# Altium schematic sheet fpga_power.SchDoc
size A4
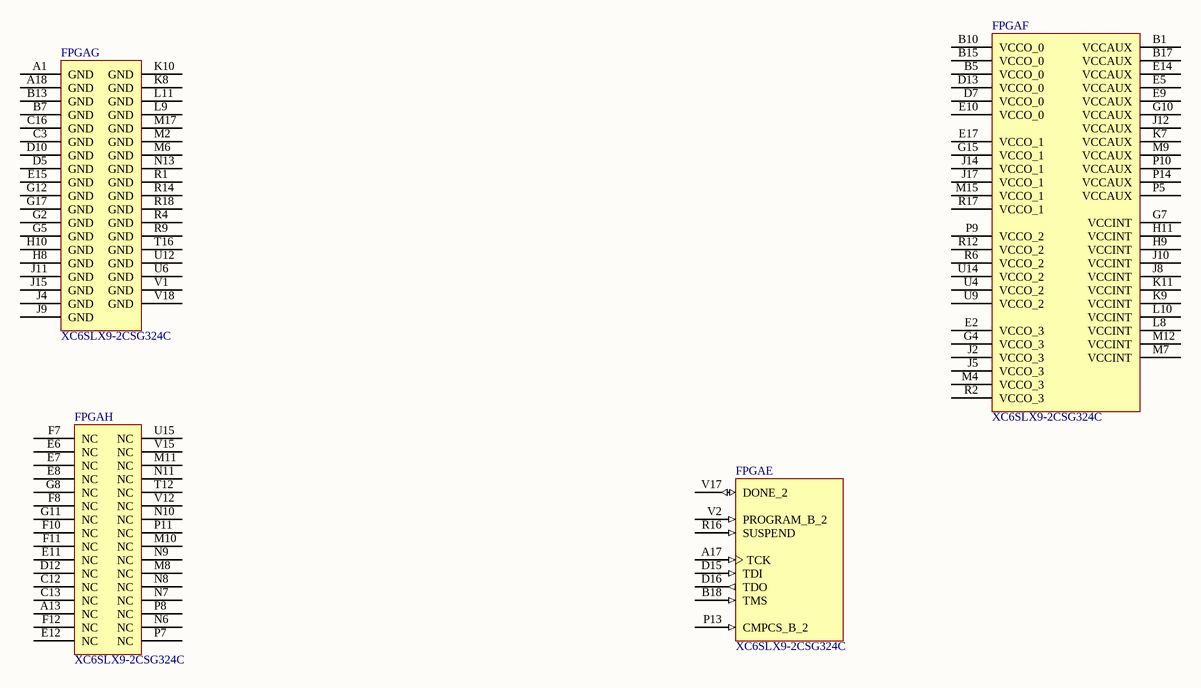
[diagram p0: fpga_power.SchDoc]

## Parts
FPGA  XC6SLX9-2CSG324C  [CSG324]  (parts E,F,G,H of 8)

## Nets

Not connected (* = marked no-connect by the designer): FPGA A1(GND) A13(NC) A17(TCK) A18(GND) B1(VCCAUX) B5(VCCO_0) B7(GND) B10(VCCO_0) B13(GND) B15(VCCO_0) B17(VCCAUX) B18(TMS) C3(GND) C12(NC) C13(NC) C16(GND) D5(GND) D7(VCCO_0) D10(GND) D12(NC) D13(VCCO_0) D15(TDI) D16(TDO) E2(VCCO_3) E5(VCCAUX) E6(NC) E7(NC) E8(NC) E9(VCCAUX) E10(VCCO_0) E11(NC) E12(NC) E14(VCCAUX) E15(GND) E17(VCCO_1) F7(NC) F8(NC) F10(NC) F11(NC) F12(NC) G2(GND) G4(VCCO_3) G5(GND) G7(VCCINT) G8(NC) G10(VCCAUX) G11(NC) G12(GND) G15(VCCO_1) G17(GND) H8(GND) H9(VCCINT) H10(GND) H11(VCCINT) J2(VCCO_3) J4(GND) J5(VCCO_3) J8(VCCINT) J9(GND) J10(VCCINT) J11(GND) J12(VCCAUX) J14(VCCO_1) J15(GND) J17(VCCO_1) K7(VCCAUX) K8(GND) K9(VCCINT) K10(GND) K11(VCCINT) L8(VCCINT) L9(GND) L10(VCCINT) L11(GND) M2(GND) M4(VCCO_3) M6(GND) M7(VCCINT) M8(NC) M9(VCCAUX) M10(NC) M11(NC) M12(VCCINT) M15(VCCO_1) M17(GND) N6(NC) N7(NC) N8(NC) N9(NC) N10(NC) N11(NC) N13(GND) P5(VCCAUX) P7(NC) P8(NC) P9(VCCO_2) P10(VCCAUX) P11(NC) P13(CMPCS_B_2) P14(VCCAUX) R1(GND) R2(VCCO_3) R4(GND) R6(VCCO_2) R9(GND) R12(VCCO_2) R14(GND) R16(SUSPEND) R17(VCCO_1) R18(GND) T12(NC) T16(GND) U4(VCCO_2) U6(GND) U9(VCCO_2) U12(GND) U14(VCCO_2) U15(NC) V1(GND) V2(PROGRAM_B_2) V12(NC) V15(NC) V17(DONE_2) V18(GND)

## Library data of the parts
FPGA = XC6SLX9-2CSG324C: Spartan-6 LX 1.2V FPGA, 200 User I/Os, 324-Ball Chip-Scale BGA (0.8mm Pitch), Speed Grade 2, Commercial Grade, Pb-Free; DatasheetVersion: ver1.6, Nov-2010; PackageVersion: ver1.1, Nov-2009; PackageReference: CSG324; PackageDescription: 324-Ball Chip-Scale BGA (CSG324) Package, 0.8 mm Pitch; Code_JEDEC: MO-275-KKAC-1; ComponentLink1Description: Manufacturer URL; ComponentLink1URL: http://www.xilinx.com/; ComponentLink2Description: Spartan-6 Datasheet; ComponentLink2URL: http://www.xilinx.com/support/documentation/data_sheets/ds160.pdf; ComponentLink3Description: Spartan-6 Documents; ComponentLink3URL: http://www.xilinx.com/support/documentation/spartan-6.htm